# EAGLE schematic PCB_MAT_BALISE (EAGLE 9.5.1)
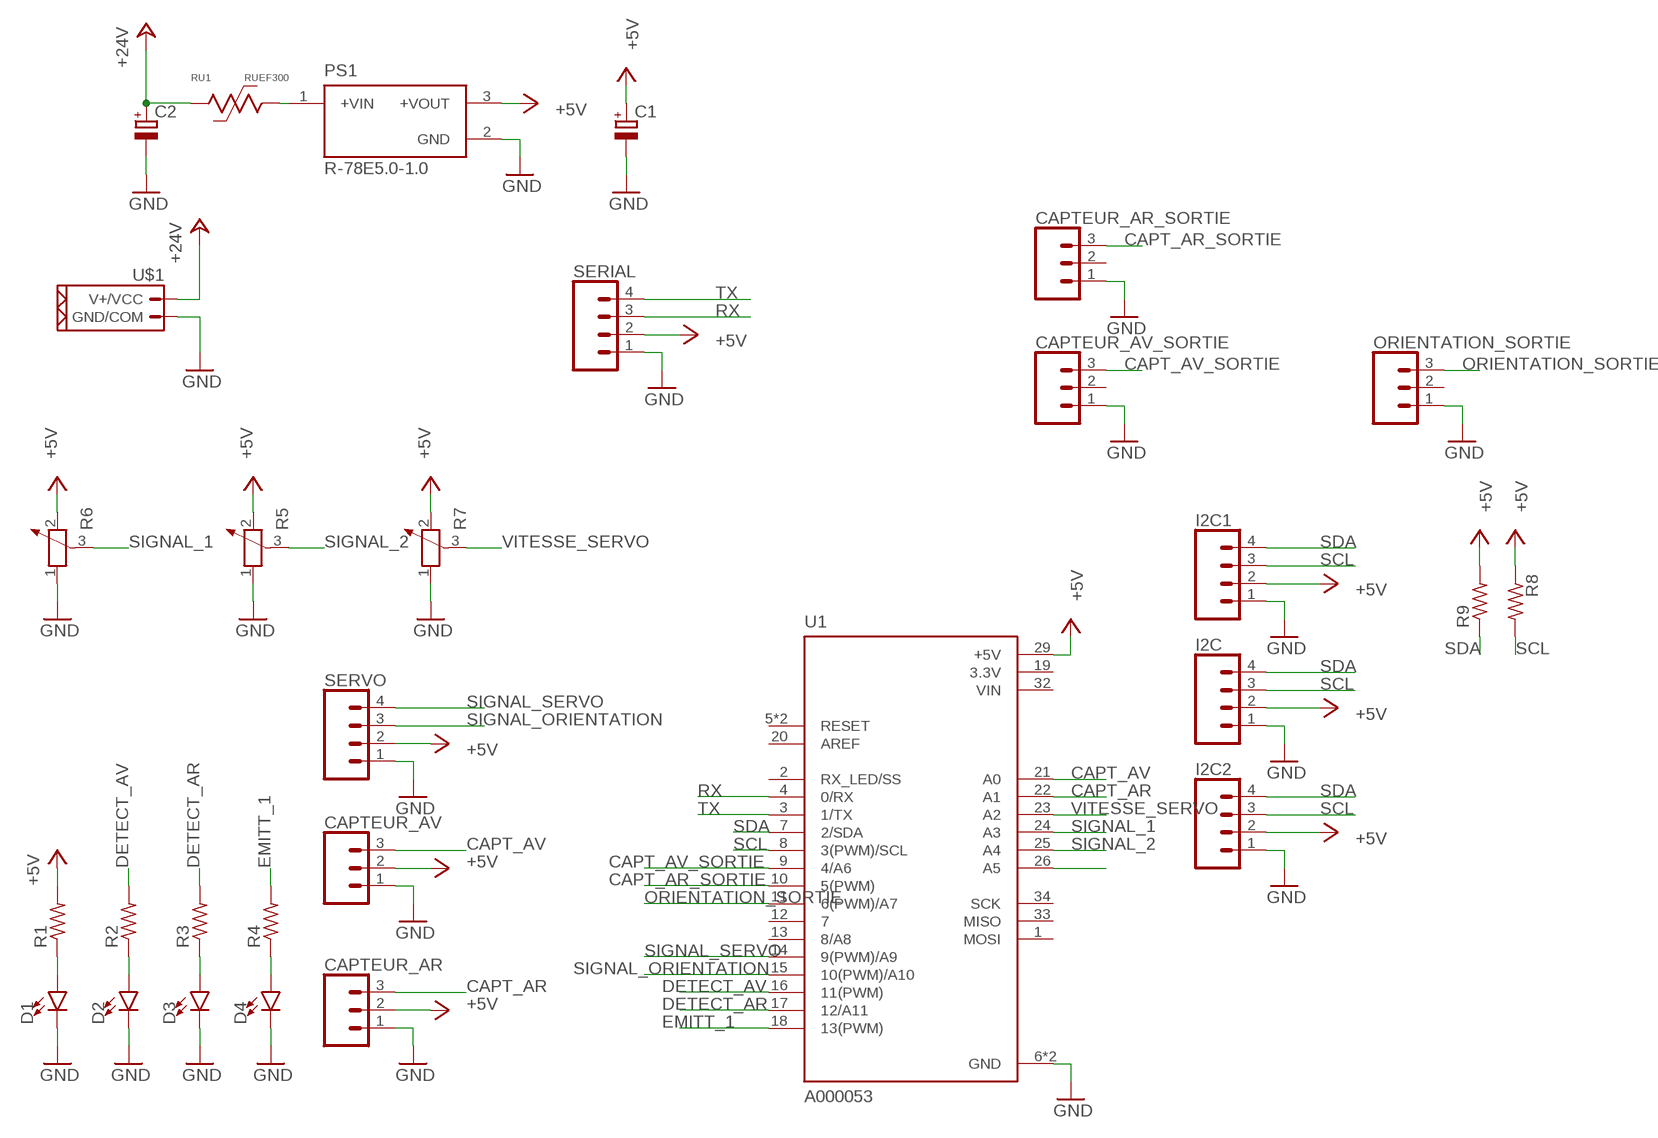
[diagram p0: schematic, sheet 1]

## Parts
C1  CPOL-EUE5-10.5  [E5-10,5]
C2  CPOL-EUE2.5-7  [E2,5-7]
CAPTEUR_AR  CONN_03POLAR  [MOLEX-1X3]
CAPTEUR_AR_SORTIE  CONN_03POLAR  [MOLEX-1X3]
CAPTEUR_AV  CONN_03POLAR  [MOLEX-1X3]
CAPTEUR_AV_SORTIE  CONN_03POLAR  [MOLEX-1X3]
D1  LED5MM  [LED_5MM]
D2  LED5MM  [LED_5MM]
D3  LED5MM  [LED_5MM]
D4  LED5MM  [LED_5MM]
I2C  CONN_04POLAR  [MOLEX-1X4]
I2C1  CONN_04POLAR  [MOLEX-1X4]
I2C2  CONN_04POLAR  [MOLEX-1X4]
ORIENTATION_SORTIE  CONN_03POLAR  [MOLEX-1X3]
PS1  R-78E5.0-1.0  [CONV_R-78E5.0-1.0]
R1  RES-US1206FAB  [R1206FAB]
R2  RES-US1206FAB  [R1206FAB]
R3  RES-US1206FAB  [R1206FAB]
R4  RES-US1206FAB  [R1206FAB]
R5  POTENTIOMETER_PT-10  [PT-10]
R6  POTENTIOMETER_PT-10  [PT-10]
R7  POTENTIOMETER_PT-10  [PT-10]
R8  RES-US1206FAB  [R1206FAB]
R9  RES-US1206FAB  [R1206FAB]
RU1  RUEF300  [RUEF300]
SERIAL  CONN_04POLAR  [MOLEX-1X4]
SERVO  CONN_04POLAR  [MOLEX-1X4]
U1  A000053  [ARDUINO_A000053]
U$1  CONN_02_PUI  [NSK396-2C]

## Nets
+5V: C1.+ CAPTEUR_AR.2 CAPTEUR_AV.2 I2C1.2 I2C2.2 I2C.2 PS1.3(+VOUT) R1.2 R5.2 R6.2 R7.2 R8.1 R9.2 SERIAL.2 SERVO.2 U1.29(+5V)
+24V: C2.+ RU1.P$1 U$1.P$2(V+/VCC)
CAPT_AR: CAPTEUR_AR.3 U1.22(A1)
CAPT_AR_SORTIE: CAPTEUR_AR_SORTIE.3 U1.10(5(PWM))
CAPT_AV: CAPTEUR_AV.3 U1.21(A0)
CAPT_AV_SORTIE: CAPTEUR_AV_SORTIE.3 U1.9(4/A6)
DETECT_AR: R3.2 U1.17(12/A11)
DETECT_AV: R2.2 U1.16(11(PWM))
EMITT_1: R4.2 U1.18(13(PWM))
GND: C1.- C2.- CAPTEUR_AR.1 CAPTEUR_AR_SORTIE.1 CAPTEUR_AV.1 CAPTEUR_AV_SORTIE.1 D1.K(C) D2.K(C) D3.K(C) D4.K(C) I2C1.1 I2C2.1 I2C.1 ORIENTATION_SORTIE.1 PS1.2(GND) R5.1 R6.1 R7.1 SERIAL.1 SERVO.1 U1.6(GND) U1.31(GND) U$1.P$1(GND/COM)
N$1: D1.A R1.1
N$2: D2.A R2.1
N$3: D3.A R3.1
N$4: D4.A R4.1
N$5: PS1.1(+VIN) RU1.P$2
N$10: U1.26(A5)
ORIENTATION_SORTIE: ORIENTATION_SORTIE.3 U1.11(6(PWM)/A7)
RX: SERIAL.3 U1.4(0/RX)
SCL: I2C1.3 I2C2.3 I2C.3 R8.2 U1.8(3(PWM)/SCL)
SDA: I2C1.4 I2C2.4 I2C.4 R9.1 U1.7(2/SDA)
SIGNAL_1: R6.3 U1.24(A3)
SIGNAL_2: R5.3 U1.25(A4)
SIGNAL_ORIENTATION: SERVO.3 U1.15(10(PWM)/A10)
SIGNAL_SERVO: SERVO.4 U1.14(9(PWM)/A9)
TX: SERIAL.4 U1.3(1/TX)
VITESSE_SERVO: R7.3 U1.23(A2)
Unconnected: CAPTEUR_AR_SORTIE.2 CAPTEUR_AV_SORTIE.2 ORIENTATION_SORTIE.2 U1.1(MOSI) U1.2(RX_LED/SS) U1.5(RESET) U1.12 U1.13(8/A8) U1.20(AREF) U1.30(RESET) U1.33(MISO) U1.34(SCK)

## Power pins joined to a net without a drawn wire
3.3V: U1.19(3.3V)
VIN: U1.32(VIN)

## Library data of the parts
C1 C2 = rcl:CPOL-EU: POLARIZED CAPACITOR, European symbol; SPICEPREFIX: C
CAPTEUR_AR CAPTEUR_AR_SORTIE CAPTEUR_AV CAPTEUR_AV_SORTIE ORIENTATION_SORTIE = CONNECTORS:CONN_03: Multi connection point. Often used as Generic Header-pin footprint for 0.1 inch spaced/style header connections On any of the 0.1 inch spaced packages, you can populate with these: Break Away Headers - Straight <https://www.sparkfun.com/products/116> (PRT-00116) Break Away Male Headers - Right Angle <https://www.sparkfun.com/products/553> (PRT-00553) Female Headers <https://www.sparkfun.com/products/115> (PRT-00115) Break Away Headers - Machine Pin <https://www.sparkfun.com/products/117> (PRT-00117) Break Away Female Headers - Swiss Machine Pin <https://www.sparkfun.com/products/743> (PRT-00743) Stackable Header - 3 Pin (Female, 0.1") <https://www.sparkfun.com/products/13875> (PRT-13875) For SCREWTERMINALS and SPRING TERMINALS visit here: Screw Terimnals on SparkFun.com <https://www.sparkfun.com/search/results?term=Screw+Terminals> (5mm/3.5mm/2.54mm spacing) This device is also useful as a general connection point to wire up your design to another part of your project. Our various solder wires solder well into these plated through hole pads. Hook-Up Wire - Assortment (Stranded, 22 AWG) <https://www.sparkfun.com/products/11375> (PRT-11375) Hook-Up Wire - Assortment (Solid Core, 22 AWG) <https://www.sparkfun.com/products/11367> (PRT-11367) View the entire wire category on our website here <https://www.sparkfun.com/categories/141> Special notes: Molex polarized connector foot print use with SKU : PRT-08232 with associated crimp pins and housings.; PROD_ID: CONN-08625; SF_ID: PRT-08096
D1-D4 = OPENBOT:LED: LED (Generic) Standard schematic elements and footprints for 5mm, 3mm, 1206, and 0603 sized LEDs. Generic LEDs with no color specified.
I2C I2C1 I2C2 SERIAL SERVO = CONNECTORS:CONN_04: Multi connection point. Often used as Generic Header-pin footprint for 0.1 inch spaced/style header connections On any of the 0.1 inch spaced packages, you can populate with these: Break Away Headers - Straight <https://www.sparkfun.com/products/116> (PRT-00116) Break Away Male Headers - Right Angle <https://www.sparkfun.com/products/553> (PRT-00553) Female Headers <https://www.sparkfun.com/products/115> (PRT-00115) Break Away Headers - Machine Pin <https://www.sparkfun.com/products/117> (PRT-00117) Break Away Female Headers - Swiss Machine Pin <https://www.sparkfun.com/products/743> (PRT-00743) For SCREWTERMINALS and SPRING TERMINALS visit here: Screw Terimnals on SparkFun.com <https://www.sparkfun.com/search/results?term=Screw+Terminals> (5mm/3.5mm/2.54mm spacing) This device is also useful as a general connection point to wire up your design to another part of your project. Our various solder wires solder well into these plated through hole pads. Hook-Up Wire - Assortment (Stranded, 22 AWG) <https://www.sparkfun.com/products/11375> (PRT-11375) Hook-Up Wire - Assortment (Solid Core, 22 AWG) <https://www.sparkfun.com/products/11367> (PRT-11367) View the entire wire category on our website here <https://www.sparkfun.com/categories/141> Special notes: Molex polarized connector foot print use with SKU : PRT-08231 with associated crimp pins and housings. 1MM SMD Version SKU: PRT-10208; PROD_ID: CONN-08186; SF_ID: PRT-08231
PS1 = KARIBOUS:R-78E5.0-1.0: 1.0 Amp SIP3 Single Output; DESCRIPTION: R-78E-1 Series 5 W 8 to 28 Vin 5 V Output DC/DC Converter - SIP-3; DIGI-KEY_PART_NUMBER: 945-2201-ND; DIGI-KEY_PURCHASE_URL: https://www.digikey.com/product-detail/en/recom-power/R-78E5.0-1.0/945-2201-ND/4930585?utm_source=snapeda&utm_medium=aggregator&utm_campaign=symbol; MF: Recom Power; MP: R-78E5.0-1.0; PACKAGE: SIP-3 Recom Power
R1-R4 R8 R9 = fab:RES-US: Resistor (US Symbol) Variants with postfix FAB are widened to allow the routing of internal traces
R5-R7 = rcl:POTENTIOMETER_: Potentiometer; SPICEMODEL: POT; SPICEPREFIX: X
RU1 = OPENBOT:RUEF300
U1 = A000053:A000053: MCU, ARDUINO MICRO, LEONARDO BASED, ATMEGA32u4, 5V, USB-MICRO; AVAILABILITY: Unavailable; DESCRIPTION: MCU, ARDUINO MICRO, LEONARDO BASED, ATMEGA32u4, 5V, USB-MICRO; MF: Arduino; MP: A000053; PACKAGE: None; PRICE: None
U$1 = OPENBOT:CONN_02_PUI